# Altium schematic sheet TankPins.SchDoc
size A4
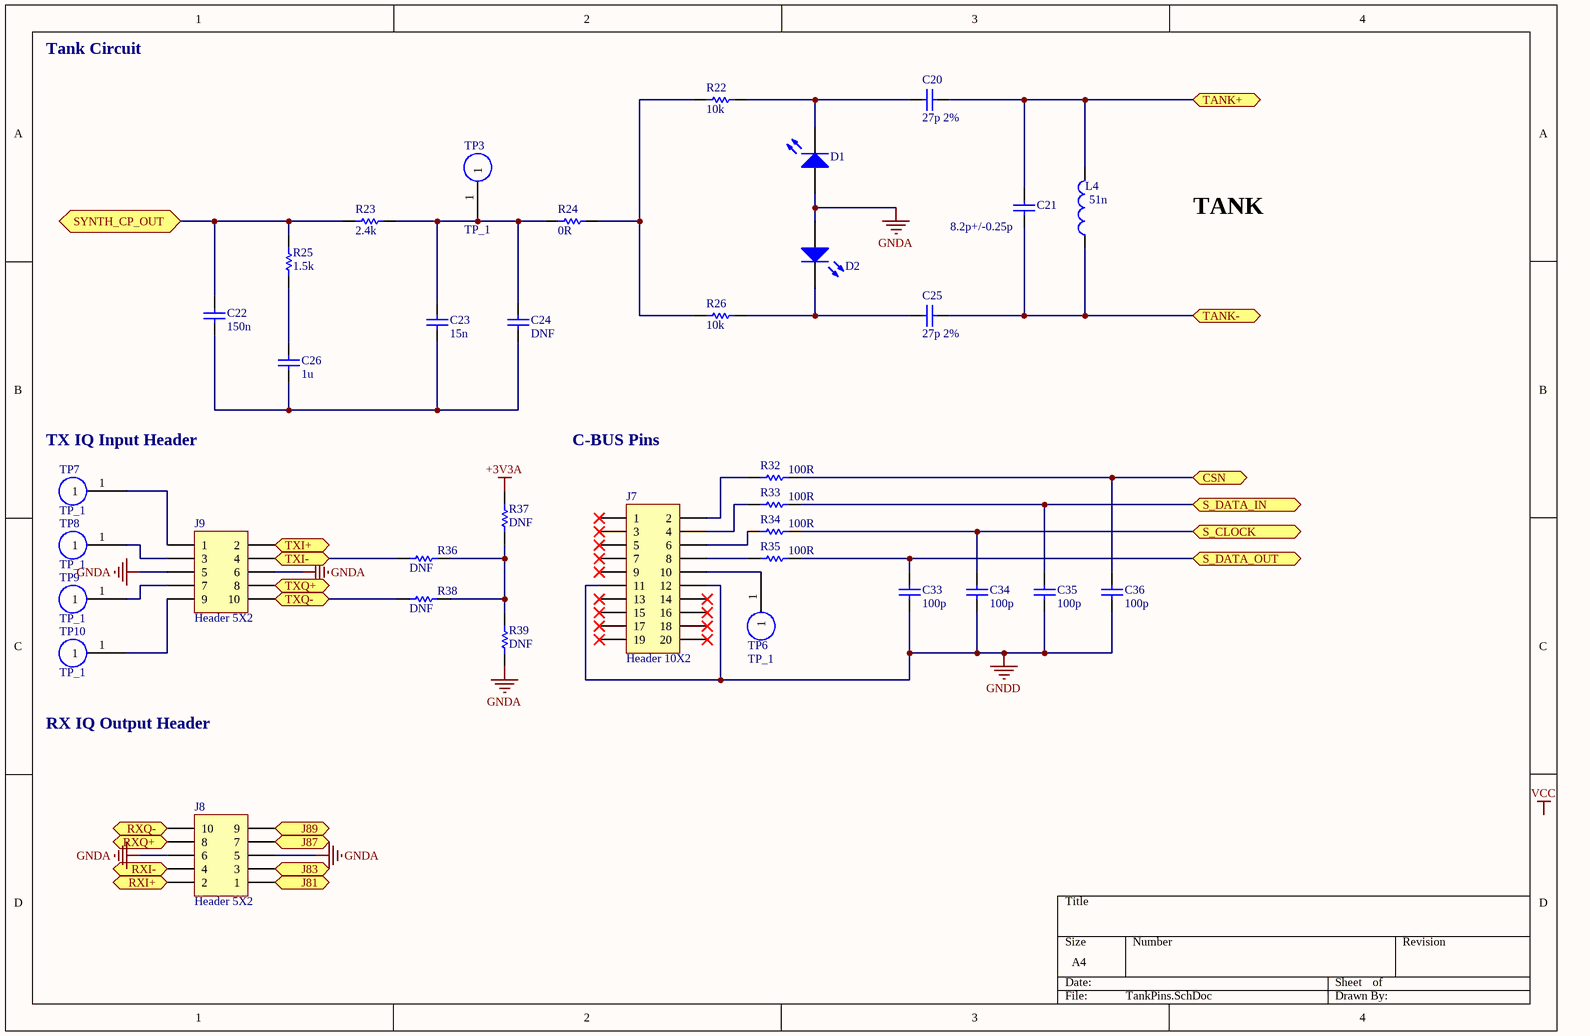
[diagram p0: TankPins.SchDoc]

## Parts
C20  value 27p 2%  [0805]  (hidden comment: Cap_0805)
C21  value 8.2p+/-0.25p  [0805]  (hidden comment: Cap_0805)
C22  value 150n  [0805]  (hidden comment: Cap_0805)
C23  value 15n  [0805]  (hidden comment: Cap_0805)
C24  value DNF  [1210]  (hidden comment: Cap_0805)
C25  value 27p 2%  [0805]  (hidden comment: Cap_0805)
C26  value 1u  [1210]  (hidden comment: Cap_0805)
C33  value 100p  [0805]  (hidden comment: Cap_0805)
C34  value 100p  [0805]  (hidden comment: Cap_0805)
C35  value 100p  [0805]  (hidden comment: Cap_0805)
C36  value 100p  [0805]  (hidden comment: Cap_0805)
D1  LED_603  [0805 - LED]  (value not drawn)
D2  LED_603  [0805 - LED]  (value not drawn)
J7  Header 10X2  [HDR2X10]
J8  Header 5X2  [HDR2X5]
J9  Header 5X2  [HDR2X5]
L4  51n  [0805]
R22  value 10k  [0805]  (hidden comment: Res_0805)
R23  value 2.4k  [0805]  (hidden comment: Res_0805)
R24  value 0R  [0805]  (hidden comment: Res_0805)
R25  value 1.5k  [0805]  (hidden comment: Res_0805)
R26  value 10k  [0805]  (hidden comment: Res_0805)
R32  value 100R  [0805]  (hidden comment: Res_0805)
R33  value 100R  [0805]  (hidden comment: Res_0805)
R34  value 100R  [0805]  (hidden comment: Res_0805)
R35  value 100R  [0805]  (hidden comment: Res_0805)
R36  value DNF  [0805]  (hidden comment: Res_0805)
R37  value DNF  [0805]  (hidden comment: Res_0805)
R38  value DNF  [0805]  (hidden comment: Res_0805)
R39  value DNF  [0805]  (hidden comment: Res_0805)
TP3  TP_1  [test_point]
TP6  TP_1  [test_point]
TP7  TP_1  [test_point]
TP8  TP_1  [test_point]
TP9  TP_1  [test_point]
TP10  TP_1  [test_point]

## Ports
CSN (bidir), J81 (bidir), J83 (bidir), J87 (bidir), J89 (bidir), RXI+ (bidir), RXI- (bidir), RXQ+ (bidir), RXQ- (bidir), S_CLOCK (bidir), S_DATA_IN, S_DATA_OUT (bidir), SYNTH_CP_OUT (bidir), TANK+, TANK-, TXI+ (bidir), TXI- (bidir), TXQ+ (bidir), TXQ- (bidir)

## Nets
+3V3A: R37.1
GNDA: D1.1(A) D2.1(A) J8.5 J8.6 J9.5 J9.6 R39.2
GNDD: C33.1 C34.1 C35.1 C36.1 J7.11 J7.12
CSN: C36.2 R32.2 ; port CSN
J81: J8.1 ; port J81
J83: J8.3 ; port J83
J87: J8.7 ; port J87
J89: J8.9 ; port J89
RXI+: J8.2 ; port RXI+
RXI-: J8.4 ; port RXI-
RXQ+: J8.8 ; port RXQ+
RXQ-: J8.10 ; port RXQ-
S_CLOCK: C34.2 R34.2 ; port S_CLOCK
S_DATA_IN: C35.2 R33.2 ; port S_DATA_IN
S_DATA_OUT: C33.2 R35.2 ; port S_DATA_OUT
SYNTH_CP_OUT: C22.1 R23.1 R25.1 ; port SYNTH_CP_OUT
TANK+: C20.2 C21.2 L4.2 ; port TANK+
TANK-: C21.1 C25.2 L4.1 ; port TANK-
TXI+: J9.2 ; port TXI+
TXI-: J9.4 R36.1 ; port TXI-
TXQ+: J9.8 ; port TXQ+
TXQ-: J9.10 R38.1 ; port TXQ-
NetC20_1: C20.1 D1.2(K) R22.2
NetC22_2: C22.2 C23.1 C24.1 C26.1
NetC23_2: C23.2 C24.2 R23.2 R24.1 TP3.1
NetC25_1: C25.1 D2.2(K) R26.2
NetC26_2: C26.2 R25.2
NetJ7_2: J7.2 R32.1
NetJ7_4: J7.4 R33.1
NetJ7_6: J7.6 R34.1
NetJ7_8: J7.8 R35.1
NetJ7_10: J7.10 TP6.1
NetJ9_1: J9.1 TP7.1
NetJ9_3: J9.3 TP8.1
NetJ9_7: J9.7 TP9.1
NetJ9_9: J9.9 TP10.1
NetR22_1: R22.1 R24.2 R26.1
NetR36_2: R36.2 R37.2 R38.2 R39.1

Not connected (* = marked no-connect by the designer): J7 1* 3* 5* 7* 9* 13* 14* 15* 16* 17* 18* 19* 20*

## Notes on the sheet
- Tank Circuit
- TANK
- (near TP7) TX IQ Input Header
- C-BUS Pins
- RX IQ Output Header
- Labels drawn without touching a wire or pin: VCC

## Library data of the parts
C20-C26 C33-C36 = Cap_0805: ABE_Capacitor; Ozdisan Link: *; Ozdisan P/N: *; DigiKey P/N: *; DigiKey Link: *; Package: 0805
D1 D2 = LED_603: ABE_LED
J7 = Header 10X2: Header, 10-Pin, Dual row; LatestRevisionDate: 17-Jul-2002; LatestRevisionNote: Re-released for DXP Platform.; Publisher: Altium Limited
J8 J9 = Header 5X2: Header, 5-Pin, Dual row; LatestRevisionDate: 17-Jul-2002; LatestRevisionNote: Re-released for DXP Platform.; Publisher: Altium Limited
L4 = 28F0121-0SR-10: Laird Technologies Ferrite Bead, 3.05 x 2.54 x 4.06mm (2030 (5030M)), 30 impedance at 25 MHz; Geometry.Height: 3.05mm; Mouser Part Number: N/A; Mouser Price/Stock: https://www.mouser.co.uk/ProductDetail/Laird/28F0121-0SR-10?qs=PzGy0jfpSMvqclEvolMrsg%3D%3D; Manufacturer_Name: Laird Technologies; Manufacturer_Part_Number: 28F0121-0SR-10; Datasheet Link: https://datasheet.datasheetarchive.com/originals/distributors/Datasheets-DGA6/557085.pdf
R22-R26 R32-R39 = Res_0805: ABE_Resistor; Ozdisan Link: *; Ozdisan P/N: *; DigiKey P/N: *; DigiKey Link: *; Package: 0805
TP3 TP6-TP10 = test_point: Testpoint1: *